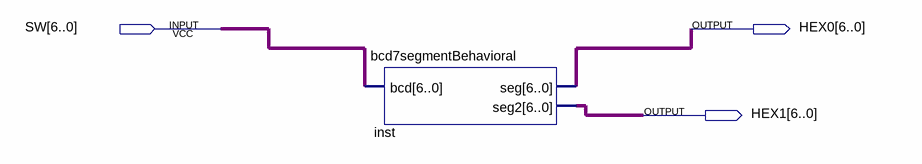
[diagram p0: schematic sheet]
// Quartus schematic display.bdf as structural Verilog: 1 symbols, 3 pins
module display (
  input  [6:0] SW,
  output [6:0] HEX0,
  output [6:0] HEX1
);

  bcd7segmentBehavioral inst (.bcd(SW), .seg(HEX0), .seg2(HEX1));
endmodule
